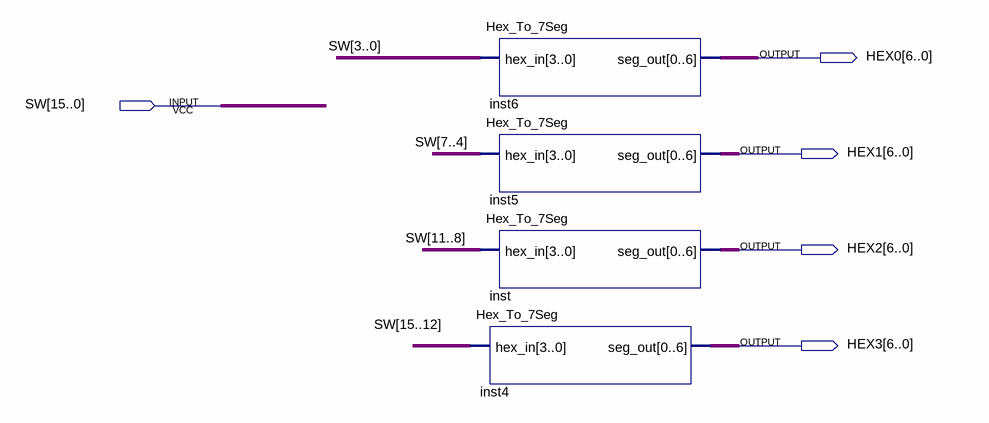
[diagram p0: schematic sheet]
// Quartus schematic 16bit2SSD.bdf as structural Verilog: 4 symbols, 5 pins
module \16bit2SSD  (
  input  [15:0] SW,
  output [6:0] HEX0,
  output [6:0] HEX1,
  output [6:0] HEX2,
  output [6:0] HEX3
);

  Hex_To_7Seg inst6 (.hex_in(SW[3:0]), .seg_out(HEX0));
  Hex_To_7Seg inst5 (.hex_in(SW[7:4]), .seg_out(HEX1));
  Hex_To_7Seg inst (.hex_in(SW[11:8]), .seg_out(HEX2));
  Hex_To_7Seg inst4 (.hex_in(SW[15:12]), .seg_out(HEX3));
endmodule
